# EasyEDA Pro project 51单片机.eprj

# Schematic 51单片机核心板原理图
Board Name: 51单片机核心板; Create Date: 2025-07-16; Page Name: P1; Project Name: 51单片机; Schematic Name: 51单片机核心板原理图; Update Date: 2025-07-16; Company: 嘉立创EDA; Page Size: A4; Version: V1.0
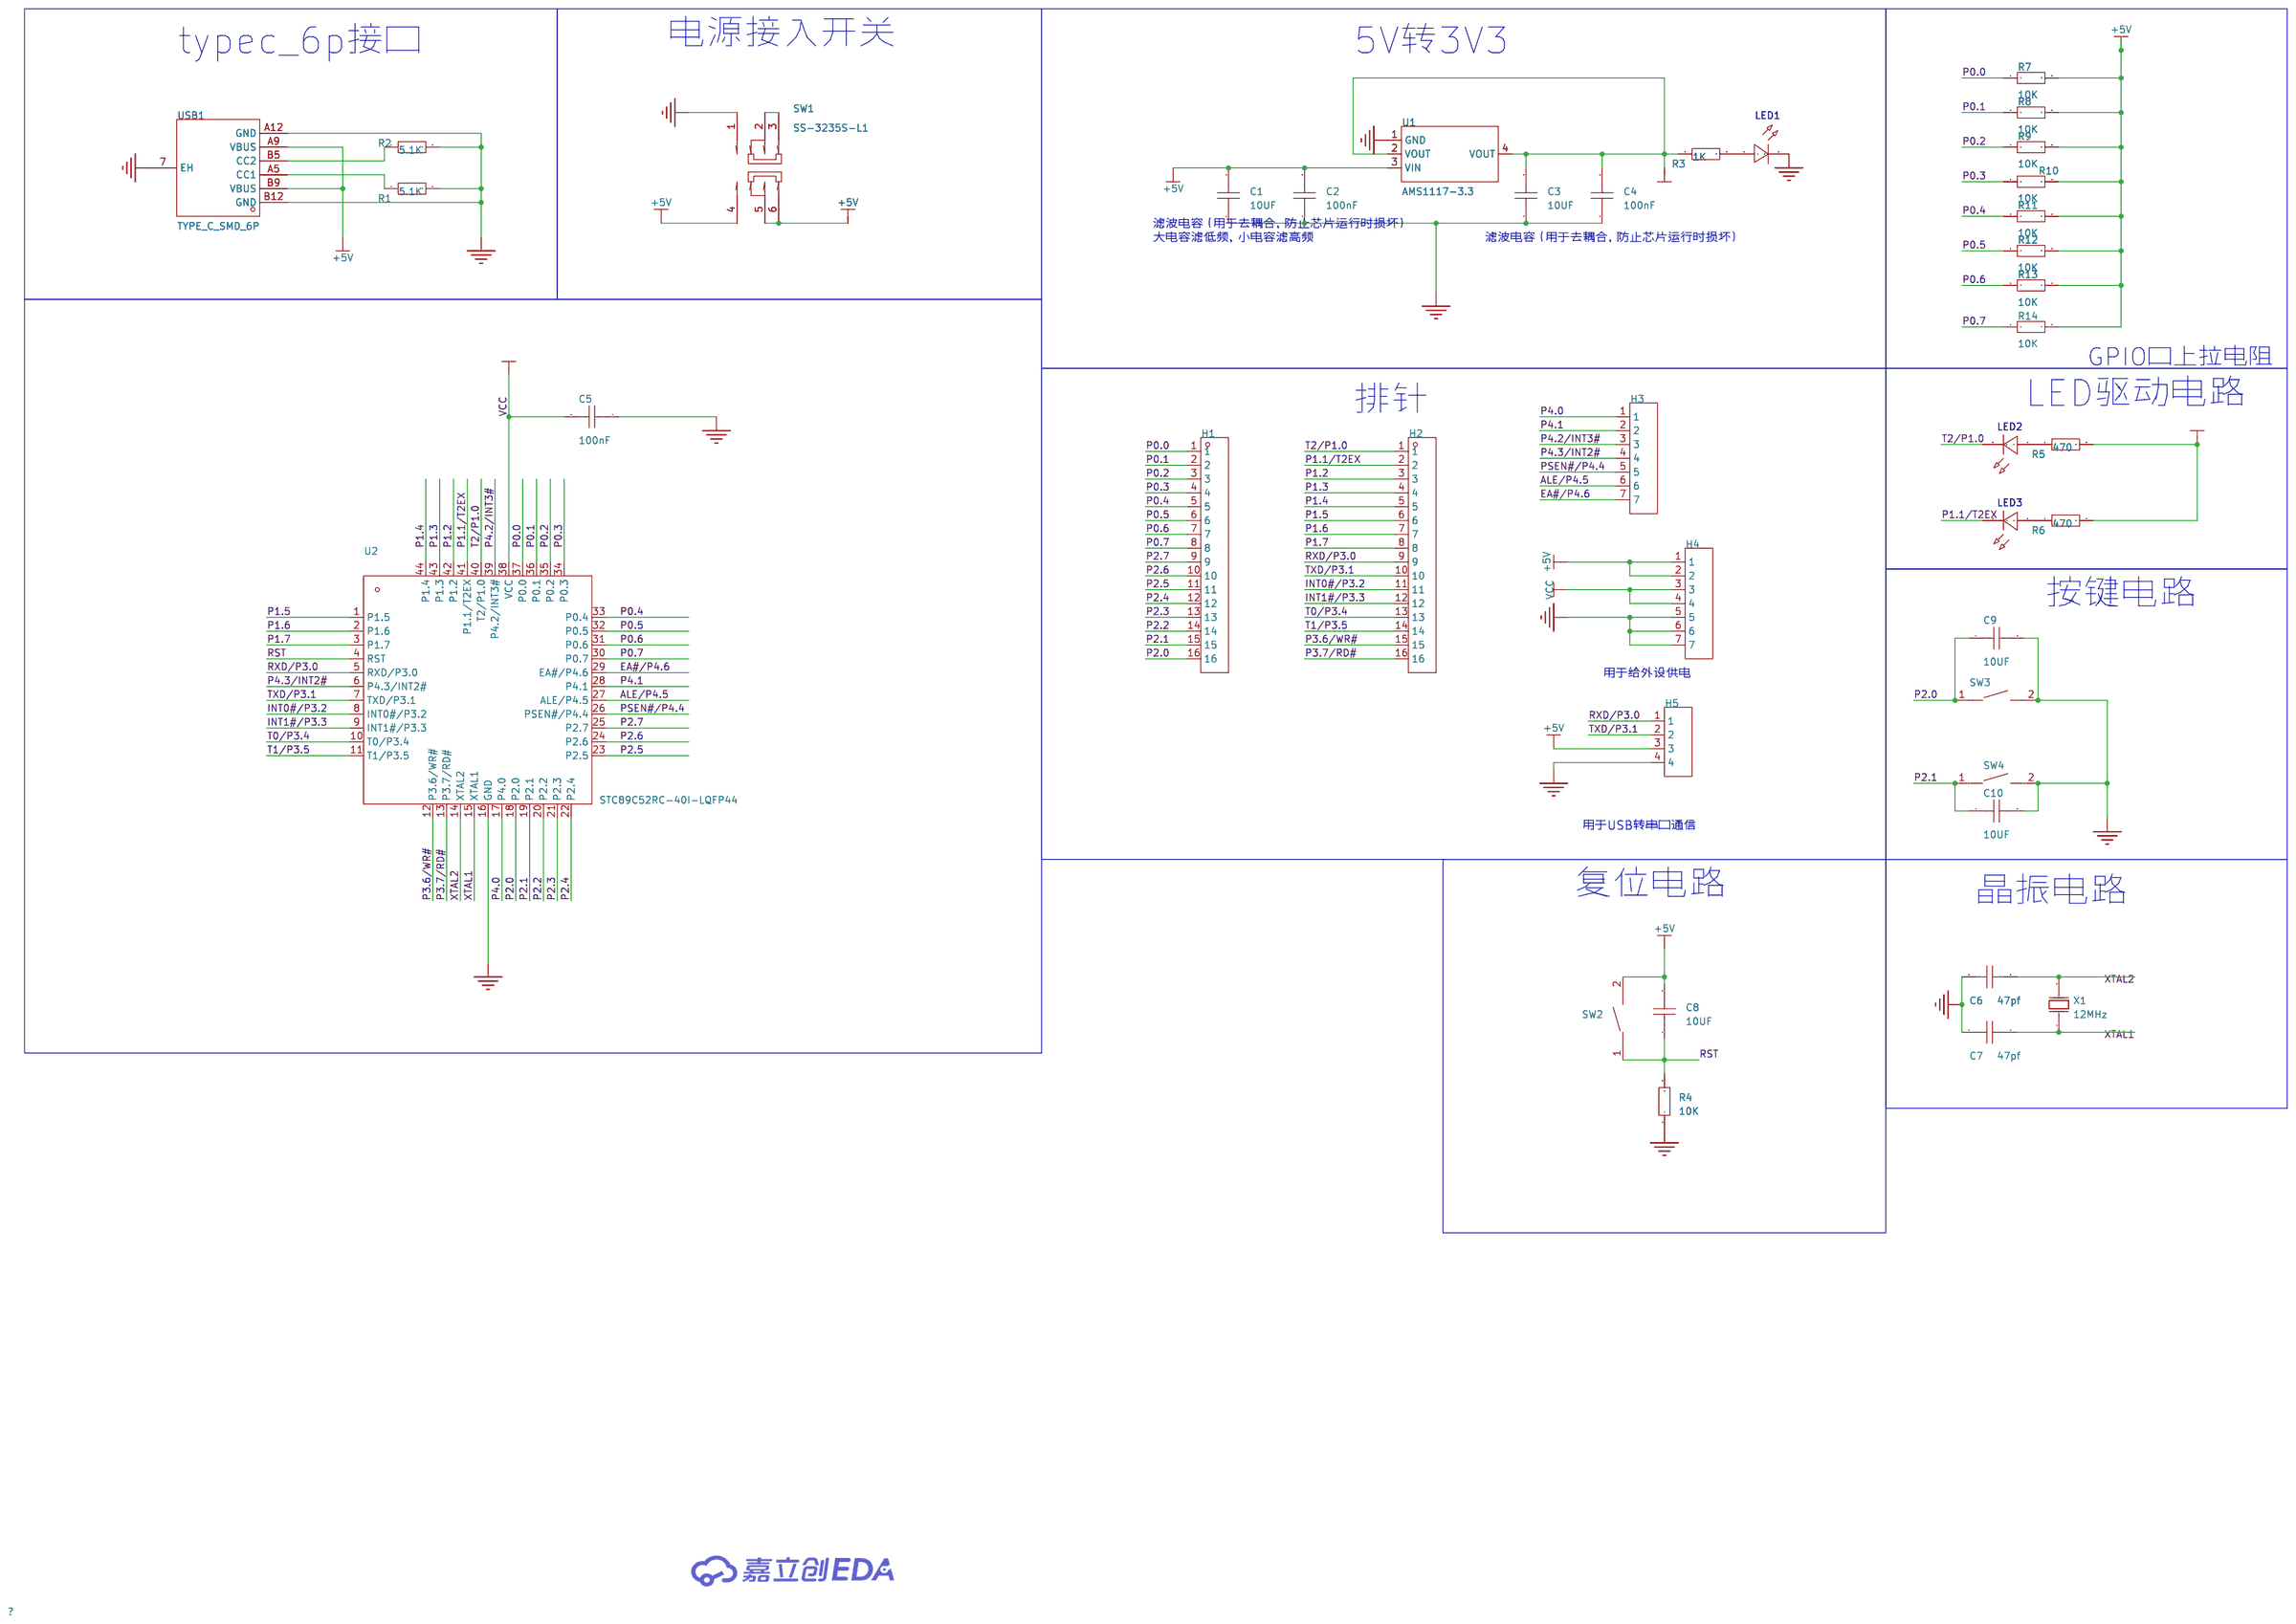
[diagram p0: schematic sheet]

## Parts
C1  10UF  [C0805]
C2  100nF  [C0805]
C3  10UF  [C0805]
C4  100nF  [C0805]
C5  100nF  [C0805]
C6  47pf  [C0805]
C7  47pf  [C0805]
C8  10UF  [C0805]
C9  10UF  [C0805]
C10  10UF  [C0805]
H1  -  [HDR-TH_16P-P2.54-V-M]
H2  -  [HDR-TH_16P-P2.54-V-M]
H3  -  [HDR-TH_7P-P2.54-V-M]
H4  -  [HDR-TH_7P-P2.54-V-M]
H5  -  [HDR-TH_4P-P2.54-V-M]
LED1  -  [LED_0805]
LED2  -  [LED_0805]
LED3  -  [LED_0805]
R1  5.1K  [R0805]
R2  5.1K  [R0805]
R3  1K  [R0805]
R4  10K  [R0805]
R5  470  [R0805]
R6  470  [R0805]
R7  10K  [R0805]
R8  10K  [R0805]
R9  10K  [R0805]
R10  10K  [R0805]
R11  10K  [R0805]
R12  10K  [R0805]
R13  10K  [R0805]
R14  10K  [R0805]
SW1  SS-3235S-L1  [SW-SMD_SS-3235S-LX]
SW2  轻触按键3*4*H  [SW-SMD_L4.0-W2.9-LS5.0]
SW3  轻触按键3*4*H  [SW-SMD_L4.0-W2.9-LS5.0]
SW4  轻触按键3*4*H  [SW-SMD_L4.0-W2.9-LS5.0]
U1  AMS1117-3.3  [SOT-223-3_L6.5-W3.4-P2.30-LS7.0-BR]
U2  STC89C52RC-40I-LQFP44  [LQFP-44_L10.0-W10.0-P0.80-LS12.0-BL]
USB1  TYPE_C_SMD_6P  [TYPE-C-SMD_TYPE-C-6P]
X1  12MHz  [CRYSTAL-SMD_L7.0-W4.0-LS7.8]

## Library data of the parts
C1-C10 = CAP_0805: Supplier Footprint: 0805
H1 H2 = HDR-M_2.54_1x16P: Supplier Part: C2894939; Supplier Footprint: 插件
H3 H4 = HDR-M_2.54_1x7P: Supplier Part: C492406; Supplier Footprint: 插件
H5 = HDR-M_2.54_1x4P: Supplier Part: C492403; Supplier Footprint: 插件
LED1-LED3 = LED_0805-G: Supplier Footprint: 0805
R1-R14 = Res_0805: Supplier Footprint: 0805
SW1 = SS-3235S-L1: LCSC Part Name: 柄长2mm 卧贴双档 滑动开关; Supplier Part: C500055; Manufacturer: XKB Connectivity(中国星坤); Supplier Footprint: SMD; JLCPCB Part Class: 扩展库; Datasheet: https://atta.szlcsc.com/upload/public/pdf/source/20211011/39D516E750C13BE9339464E723D9F132.pdf; Supplier: LCSC; Circuit: 双刀双掷; Actuator Style: 矩形柱状; Pin Style: 鸥翼型; Switch Length: 9.1mm; Switch Width: 3.55mm; Switch Height: 3.2mm; Mounting Style: 卧贴; Actuator Color: 黑色; Current Rating (DC): 50mA; Voltage Rating (DC): 12V; Current Rating (AC): 50mA; Voltage Rating (AC): 12V; Mechanical Life: 1万次; Operating Temperature: -40℃~+85℃
SW2-SW4 = 轻触按键3*4*H: Supplier Part: C9900017573; Supplier Footprint: 轻触按键3*4*2.5; JLCPCB Part Class: 扩展库; Supplier: LCSC
U1 = AMS1117-3.3_C6186: LCSC Part Name: 输出3.3V 1A; Supplier Part: C6186; Manufacturer: AMS; Supplier Footprint: SOT-223; JLCPCB Part Class: 基础库; Datasheet: https://atta.szlcsc.com/upload/public/pdf/source/20180727/C6186_7A095716F0823C02F1997A905E26C086.pdf; Supplier: LCSC; Output Type: 固定; Voltage - Supply: 16V; Output Voltage: 3.3V; Output Current: 1A; Power Supply Rejection Ratio (PSRR): 72dB@(120Hz); Voltage Dropout: 1.1V@(800mA); standby current: 5mA; Features: 过流保护；过热保护; Operating Temperature: -40℃~+125℃; Output Configuration: 正极; Number of Outputs: 1
U2 = STC89C52RC-40I-LQFP44: Supplier Part: C8707; Manufacturer: STC; Supplier Footprint: LQFP-44(10x10); JLCPCB Part Class: 扩展库; Datasheet: https://atta.szlcsc.com/upload/public/pdf/source/20241226/242305099CBBF4767F79975207B2F263.pdf; Supplier: LCSC; CPU Core: 51系列; Program Storage Size: 8KB; Program Memory Type: FLASH; Number of I/O: 39; Low Voltage Detection Threshold: 3.3V~5.5V
USB1 = TYPE_C_SMD_6P: Supplier Part: C9900003080; Supplier Footprint: TYPE_C_USB_6P; JLCPCB Part Class: 扩展库; Supplier: LCSC
X1 = 12M 20PF 15PPM: LCSC Part Name: 12MHz ±15ppm 20pF; Supplier Part: C2983432; Manufacturer: SST(索斯特); Supplier Footprint: HC-49S-SMD-2P-Mini; JLCPCB Part Class: 扩展库; Datasheet: https://atta.szlcsc.com/upload/public/pdf/source/20230331/E499E3A6C35BF666DCAD57CB31E37A5D.pdf; Supplier: LCSC; Normal temperature Frequency Tolerance: ±15ppm; Load Capacitance: 20pF; Frequency Stability: ±30ppm; Operating Temperature: -20℃~+70℃

## Nets
3V3: C3.2 C4.2 R3.1 R5.2 R6.2 U1.2(VOUT) U1.4(VOUT)
+5V: C1.2 C2.2 C8.2 H4.1 H4.2 H5.3 R7.2 R8.2 R9.2 R10.2 R11.2 R12.2 R13.2 R14.2 SW1.4 SW1.5 SW1.6 SW2.2 U1.3(VIN) USB1.A9(VBUS) USB1.B9(VBUS)
GND: C1.1 C2.1 C3.1 C4.1 C5.1 C6.1 C7.1 C9.2 C10.2 H4.5 H4.6 H4.7 H5.4 LED1.1(C) R1.2 R2.2 R4.1 SW1.1 SW3.2 SW4.2 U1.1(GND) U2.16(GND) USB1.7(EH) USB1.A12(GND) USB1.B12(GND)
VCC: C5.2 H4.3 H4.4 U2.38(VCC)
ALE/P4.5: H3.6 U2.27(ALE/P4.5)
EA#/P4.6: H3.7 U2.29(EA#/P4.6)
INT0#/P3.2: H2.11 U2.8(INT0#/P3.2)
INT1#/P3.3: H2.12 U2.9(INT1#/P3.3)
P0.0: H1.1 R7.1 U2.37(P0.0)
P0.1: H1.2 R8.1 U2.36(P0.1)
P0.2: H1.3 R9.1 U2.35(P0.2)
P0.3: H1.4 R10.1 U2.34(P0.3)
P0.4: H1.5 R11.1 U2.33(P0.4)
P0.5: H1.6 R12.1 U2.32(P0.5)
P0.6: H1.7 R13.1 U2.31(P0.6)
P0.7: H1.8 R14.1 U2.30(P0.7)
P1.1/T2EX: H2.2 LED3.1(C) U2.41(P1.1/T2EX)
P1.2: H2.3 U2.42(P1.2)
P1.3: H2.4 U2.43(P1.3)
P1.4: H2.5 U2.44(P1.4)
P1.5: H2.6 U2.1(P1.5)
P1.6: H2.7 U2.2(P1.6)
P1.7: H2.8 U2.3(P1.7)
P2.0: C9.1 H1.16 SW3.1 U2.18(P2.0)
P2.1: C10.1 H1.15 SW4.1 U2.19(P2.1)
P2.2: H1.14 U2.20(P2.2)
P2.3: H1.13 U2.21(P2.3)
P2.4: H1.12 U2.22(P2.4)
P2.5: H1.11 U2.23(P2.5)
P2.6: H1.10 U2.24(P2.6)
P2.7: H1.9 U2.25(P2.7)
P3.6/WR#: H2.15 U2.12(P3.6/WR#)
P3.7/RD#: H2.16 U2.13(P3.7/RD#)
P4.0: H3.1 U2.17(P4.0)
P4.1: H3.2 U2.28(P4.1)
P4.2/INT3#: H3.3 U2.39(P4.2/INT3#)
P4.3/INT2#: H3.4 U2.6(P4.3/INT2#)
PSEN#/P4.4: H3.5 U2.26(PSEN#/P4.4)
RST: C8.1 R4.2 SW2.1 U2.4(RST)
RXD/P3.0: H2.9 H5.1 U2.5(RXD/P3.0)
T0/P3.4: H2.13 U2.10(T0/P3.4)
T1/P3.5: H2.14 U2.11(T1/P3.5)
T2/P1.0: H2.1 LED2.1(C) U2.40(T2/P1.0)
TXD/P3.1: H2.10 H5.2 U2.7(TXD/P3.1)
XTAL1: C7.2 U2.15(XTAL1) X1.1(OSC1)
XTAL2: C6.2 U2.14(XTAL2) X1.2(OSC2)
$1N263: R1.1 USB1.A5(CC1)
$1N267: R2.1 USB1.B5(CC2)
$1N532: SW1.2 SW1.3
$1N934: LED1.2(A) R3.2
$1N3338: LED2.2(A) R5.1
$1N3364: LED3.2(A) R6.1

## Notes on the sheet
- typec_6p接口
- 电源接入开关
- 5V转3V3
- 滤波电容（用于去耦合，防止芯片运行时损坏）
  大电容滤低频，小电容滤高频
- 滤波电容（用于去耦合，防止芯片运行时损坏）
- GPIO口上拉电阻
- 排针
- LED驱动电路
- 按键电路
- 用于给外设供电
- 用于USB转串口通信
- 复位电路
- 晶振电路

# Board 51单片机核心板PCB
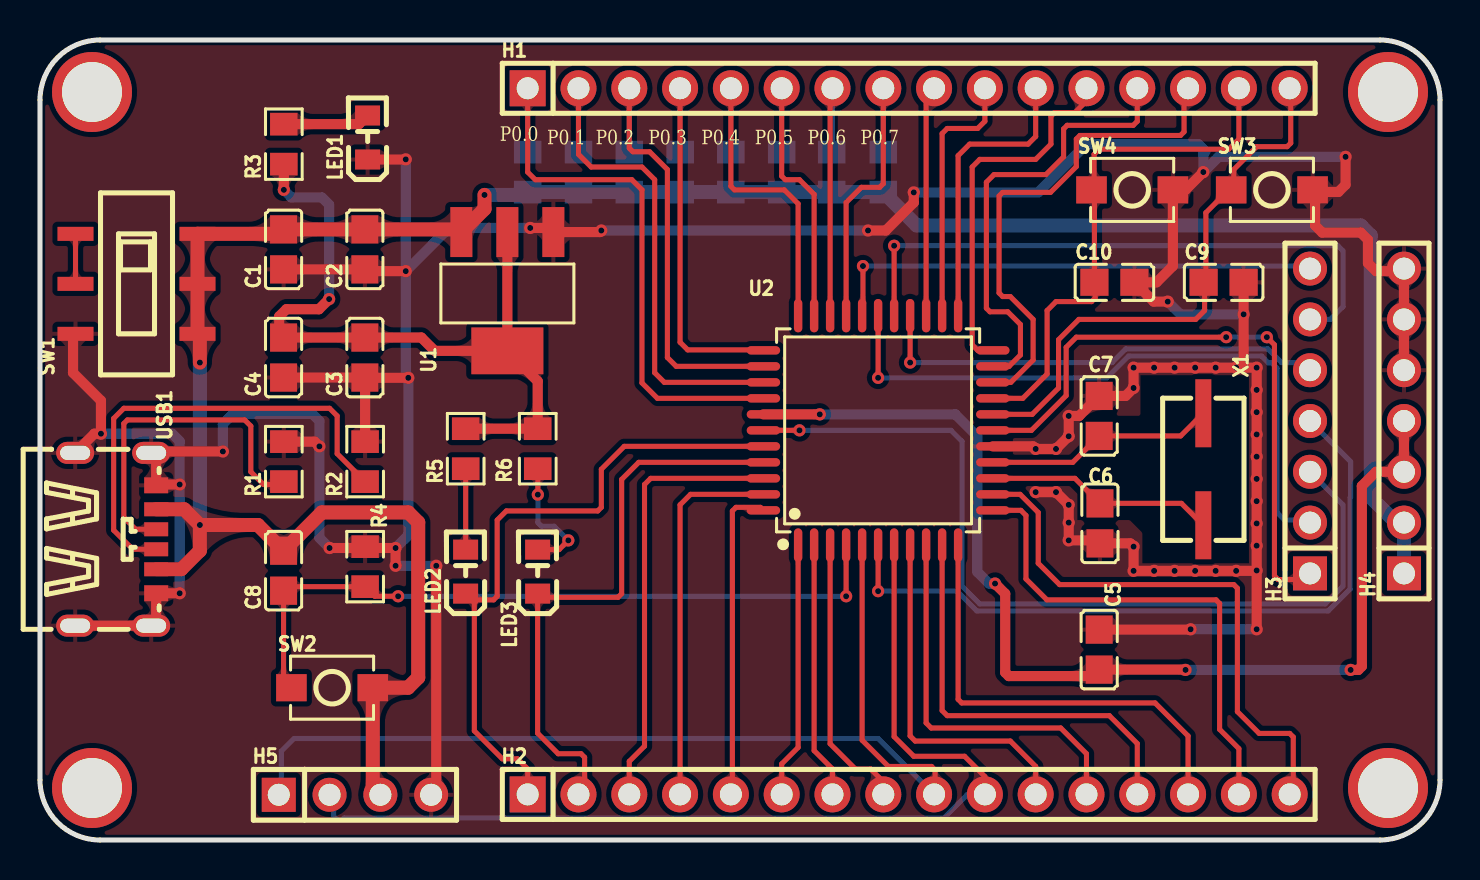
[diagram p1: board, top side]
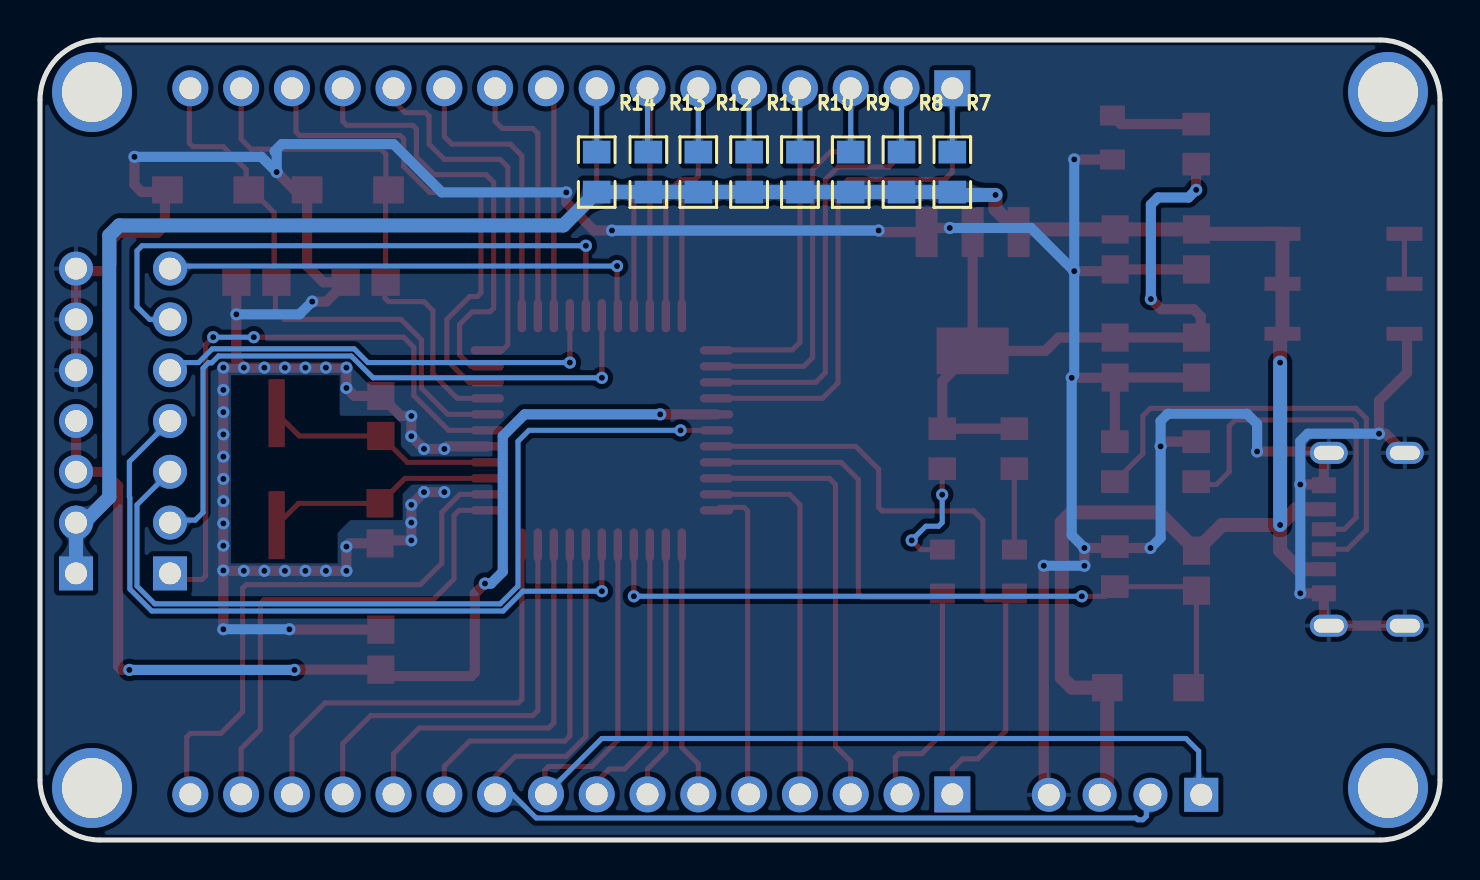
[diagram p2: board, bottom side, seen from below]

Outline 70 x 40 mm; copper layers: Top Layer, Bottom Layer. Coordinates in mm from the lower left corner of the outline.
Outline path: 0,37 0,3 arc(0.88,0.88) 3,0 67,0 arc(69.12,0.88) 70,3 70,37 arc(69.12,39.12) 67,40 3,40 arc(0.88,39.12) 0,37
Stack: Top Layer 0.035mm / Dielectric1 1.51mm FR4 er 4.5 / Bottom Layer 0.035mm

## Design rules (mm)
net XTAL2: DP1
net XTAL1: DP1
template: JLCPCB Capability(Two Layers Board)
spacing copperThickness1oz (default): track to track 0.102, other pairs 0.152 to 0.3
spacing copperThickness2oz: track to track 0.203, other pairs 0.152 to 0.3
track width copperThickness1oz (default): min 0.127, default 0.254, max 2.54
track width copperThickness2oz: min 0.203, default 0.254, max 2.54
differential pair differentialPair (default): width min 0.127, default 0.254, max 2.54; gap min 0.152, default 0.152
via viaSize (default): diameter min 0.5, default 0.61, max 10; hole min 0.3, default 0.305, max 6.3

## Placement (name value [footprint] x y rotation side)
C1  10UF  [C0805]  12.18 29.53 90 top
C2  100nF  [C0805]  16.24 29.53 90 top
C3  10UF  [C0805]  16.24 24.12 90 top
C4  100nF  [C0805]  12.18 24.12 90 top
C5  100nF  [C0805]  52.96 9.52 270 top
C6  47pf  [C0805]  53 15.83 90 top
C7  47pf  [C0805]  52.96 21.2 270 top
C8  10UF  [C0805]  12.18 13.47 90 top
C9  10UF  [C0805]  59.18 27.88 0 top
C10  10UF  [C0805]  53.72 27.88 0 top
H1  -  [HDR-TH_16P-P2.54-V-M]  43.43 37.59 0 top
H2  -  [HDR-TH_16P-P2.54-V-M]  43.43 2.28 0 top
H3  -  [HDR-TH_7P-P2.54-V-M]  63.5 20.95 90 top
H4  -  [HDR-TH_7P-P2.54-V-M]  68.2 20.95 90 top
H5  -  [HDR-TH_4P-P2.54-V-M]  15.75 2.26 0 top
LED1  -  [LED_0805]  16.38 35.17 90 top
LED2  -  [LED_0805]  21.28 13.47 90 top
LED3  -  [LED_0805]  24.89 13.47 90 top
NOREF  -  [Pad_e41]  2.6 37.4 0 top
NOREF#2  -  [Pad_e46]  67.4 2.6 0 top
NOREF#3  -  [Pad_e45]  2.6 2.6 0 top
NOREF#4  -  [Pad_e47]  67.4 37.4 0 top
R1  5.1K  [R0805]  12.19 18.92 90 top
R2  5.1K  [R0805]  16.26 18.92 90 top
R3  1K  [R0805]  12.19 34.79 90 top
R4  10K  [R0805]  16.26 13.67 270 top
R5  470  [R0805]  21.28 19.57 90 top
R6  470  [R0805]  24.89 19.57 90 top
R7  10K  [R0805]  24.38 33.4 270 bottom
R8  10K  [R0805]  26.92 33.4 270 bottom
R9  10K  [R0805]  29.46 33.4 270 bottom
R10  10K  [R0805]  32 33.4 270 bottom
R11  10K  [R0805]  34.54 33.4 270 bottom
R12  10K  [R0805]  37.08 33.4 270 bottom
R13  10K  [R0805]  39.58 33.4 270 bottom
R14  10K  [R0805]  42.16 33.4 270 bottom
SW1  SS-3235S-L1  [SW-SMD_SS-3235S-LX]  4.83 27.81 90 top
SW2  轻触按键3*4*H  [SW-SMD_L4.0-W2.9-LS5.0]  14.61 7.61 0 top
SW3  轻触按键3*4*H  [SW-SMD_L4.0-W2.9-LS5.0]  61.59 32.51 0 top
SW4  轻触按键3*4*H  [SW-SMD_L4.0-W2.9-LS5.0]  54.61 32.51 0 top
U1  AMS1117-3.3  [SOT-223-3_L6.5-W3.4-P2.30-LS7.0-BR]  23.37 27.43 90 top
U2  STC89C52RC-40I-LQFP44  [LQFP-44_L10.0-W10.0-P0.80-LS12.0-BL]  41.91 20.48 0 top
USB1  TYPE_C_SMD_6P  [TYPE-C-SMD_TYPE-C-6P]  3.78 15.04 270 top
X1  12MHz  [CRYSTAL-SMD_L7.0-W4.0-LS7.8]  58.17 18.54 270 top

## Footprints (pads in the part's own frame, mm; a bottom-side part is the same pattern mirrored in y, then rotated)
C0805
  rect 1.41x1.35 smd: 1(-1,0) 2(1,0)
CRYSTAL-SMD_L7.0-W4.0-LS7.8
  rect 3.4x0.8 smd: 1(-2.8,0) 2(2.8,0)
HDR-TH_4P-P2.54-V-M
  rect 1.7x1.7 hole 1.1: 1(-3.81,0)
  round 1.7 hole 1.1: 2(-1.27,0) 3(1.27,0) 4(3.81,0)
HDR-TH_7P-P2.54-V-M
  rect 1.7x1.7 hole 1.1: 1(-7.62,0)
  round 1.7 hole 1.1: 2(-5.08,0) 3(-2.54,0) 4(0,0) 5(2.54,0) 6(5.08,0) 7(7.62,0)
HDR-TH_16P-P2.54-V-M
  rect 1.8x1.8 hole 1.1: 1(-19.05,0)
  round 1.8 hole 1.1: 2(-16.51,0) 3(-13.97,0) 4(-11.43,0) 5(-8.89,0) 6(-6.35,0) 7(-3.81,0) 8(-1.27,0) 9(1.27,0) 10(3.81,0) 11(6.35,0) 12(8.89,0) 13(11.43,0) 14(13.97,0) 15(16.51,0) 16(19.05,0)
LED_0805
  rect 1x1.25 smd: 1(-1.15,0.005) 2(1.05,0.005)
LQFP-44_L10.0-W10.0-P0.80-LS12.0-BL
  oval 0.42x1.67 smd: 1(-4,-5.735) 2(-3.2,-5.735) 3(-2.4,-5.735) 4(-1.6,-5.735) 5(-0.8,-5.735) 6(0,-5.735) 7(0.8,-5.735) 8(1.6,-5.735) 9(2.4,-5.735) 10(3.2,-5.735) 11(4,-5.735) 23(4,5.735) 24(3.2,5.735) 25(2.4,5.735) 26(1.6,5.735) 27(0.8,5.735) 28(0,5.735) 29(-0.8,5.735) 30(-1.6,5.735) 31(-2.4,5.735) 32(-3.2,5.735) 33(-4,5.735)
  oval 1.67x0.42 smd: 12(5.735,-4) 13(5.735,-3.2) 14(5.735,-2.4) 15(5.735,-1.6) 16(5.735,-0.8) 17(5.735,0) 18(5.735,0.8) 19(5.735,1.6) 20(5.735,2.4) 21(5.735,3.2) 22(5.735,4) 34(-5.735,4) 35(-5.735,3.2) 36(-5.735,2.4) 37(-5.735,1.6) 38(-5.735,0.8) 39(-5.735,0) 40(-5.735,-0.8) 41(-5.735,-1.6) 42(-5.735,-2.4) 43(-5.735,-3.2) 44(-5.735,-4)
Pad_e41
  round 4 hole 3: 1(0,0)
Pad_e45
  round 4 hole 3: 1(0,0)
Pad_e46
  round 4 hole 3: 1(0,0)
Pad_e47
  round 4 hole 3: 1(0,0)
R0805
  rect 1.133x1.377 smd: 1(-1,0) 2(1,0)
SOT-223-3_L6.5-W3.4-P2.30-LS7.0-BR
  rect 2.5x1.1 smd: 1(2.97,-2.3) 2(2.97,0) 3(2.97,2.3)
  rect 2.34x3.6 smd: 4(-2.97,0)
SW-SMD_L4.0-W2.9-LS5.0
  rect 1.53x1.36 smd: 1(-2.035,0) 2(2.035,0)
SW-SMD_SS-3235S-LX
  rect 0.7x1.8 smd: 1(-2.5,3.05) 2(0,3.05) 3(2.5,3.05) 4(-2.5,-3.05) 5(0,-3.05) 6(2.5,-3.05)
TYPE-C-SMD_TYPE-C-6P
  oval 1.1x1.9 hole 0.7x1.5: 7(-4.32,1.775) 7(-4.32,-2.025) 7(4.32,1.775) 7(4.32,-2.025)
  rect 0.7x1.2 smd: A5(-0.5,2.025) A9(1.5,2.025) B5(0.5,2.025) B9(-1.5,2.025)
  rect 0.8x1.2 smd: A12(2.7,2.025) B12(-2.7,2.025)

## Nets
As in the schematic.

Pads without a net: NOREF 1; NOREF#2 1; NOREF#3 1; NOREF#4 1

## Via types
v1: diameter 0.61, hole 0.305, Top Layer to Bottom Layer, 76 vias

## Routing (per net, layer and track width the routed paths; a pad name or vN(x,y) marks a point on that pad's centre or on a via; arc(x,y) is an arc through that point)
3V3: length 38.1
  Top Layer w0.508: 23.37,24.46 19.73,24.46 19.07,25.12 C3.2 C4.2 11.96,25.34 11.96,26.18 12.32,26.54 13.95,26.54 v1(14.46,27.05) ; 23.37,24.46 24.89,22.94 R6.2 R5.2 ; 23.37,24.46 U1.2 ; R3.1 v1(12.19,32.51)
  Bottom Layer w0.508: v1(14.46,27.05) 14.46,31.77 14.1,32.13 12.57,32.13 v1(12.19,32.51)
+5V: length 127.9
  Top Layer w0.686: 7.99,14.47 7.06,13.54 USB1.A9
  Top Layer w0.701: v1(7.99,15.75) 7.99,14.47 ; v1(7.99,15.75) 10.89,15.75 C8.2 14.09,16.38 18.41,16.38 18.91,15.88 18.91,8.12 18.4,7.61 SW2.2 16.64,2.64 H5.3 ; v1(7.99,15.75) 7.21,16.54 USB1.B9 ; v1(7.99,23.87) 7.99,25.19 SW1.4 SW1.5 SW1.6 11.96,30.31 C1.2 C2.2 20.94,30.53 U1.3 22.22,31.55 v1(22.22,32.25)
  Bottom Layer w0.701: H4.1 H4.2 67.81,15.87 66.54,17.14 66.54,30.23 66.04,30.73 43.83,30.73 R14.2 R13.2 R12.2 R11.2 R10.2 R9.2 R8.2 R7.2 24.24,32.25 v1(22.22,32.25) ; v1(7.99,15.75) v1(7.99,23.87)
GND: length 240.2
  Top Layer w0.508: USB1.7 2.72,20.31 v1(3.05,20.31) 3.05,21.97 1.65,23.36 1.65,25.18 SW1.1 ; v1(41.4,30.47) 42.29,30.47 43.69,31.87 v1(43.69,32.38) ; v1(24.51,30.6) 25.46,30.6 U1.1 27.99,30.4 v1(28.07,30.47) ; v1(18.29,28.44) 16.33,28.44 C2.1 C1.1 ; USB1.7 5.56,10.72 5.81,10.97 USB1.A12 v1(6.98,12.34) ; v1(58.17,33.4) 57.28,32.51 SW4.2 56.65,28.7 55.83,27.88 C10.2 55.69,26.92 v1(56.39,26.92) ; C4.1 C3.1 16.26,23.11 ; v1(60.83,13.48) v1(60.83,14.72) v1(60.83,15.83) v1(60.83,16.94) v1(60.83,18.05) v1(60.83,19.17) v1(60.83,20.28) v1(60.83,21.39) v1(60.83,22.5) v1(60.83,23.62) v1(59.81,23.62) ; v1(60.83,13.48) 60.81,13.46 v1(59.81,13.46) v1(58.78,13.46) v1(57.76,13.46) v1(56.73,13.46) v1(55.71,13.46) v1(54.68,13.46) v1(54.68,14.67) 54.52,14.83 C6.1 52.85,14.98 v1(51.44,14.98) v1(51.44,15.87) v1(51.44,16.76) v1(50.8,17.39) v1(49.78,17.39) ; v1(60.83,13.48) v1(60.83,10.54) ; H5.4 19.81,2.52 v1(19.81,13.71) ; v1(6.98,17.78) 5.85,17.78 USB1.B12 5.81,19.11 5.56,19.36 5.63,19.43 v1(9.14,19.43) ; 63.74,32.4 SW3.2 ; 63.74,32.4 63.75,32.38 63.75,30.73 64.11,30.37 66.04,30.37 66.4,30.01 66.4,28.85 66.8,28.44 68.07,28.44 H4.7 H4.6 H4.5 ; 63.74,32.4 64.92,32.4 65.28,32.76 v1(65.28,34.16) ; v1(57.53,10.54) 57.51,10.52 C5.1 ; C9.2 v1(60.18,26.28) 60.18,23.99 v1(59.81,23.62) ; v1(13.97,19.68) 13.73,19.92 R1.2 ; LED1.1 18.28,34.02 v1(18.29,34.03) ; v1(18.41,23.11) 16.26,23.11 ; 16.26,23.11 R2.2 ; v1(59.81,23.62) v1(58.78,23.62) v1(57.76,23.62) v1(56.73,23.62) v1(55.71,23.62) v1(54.68,23.62) v1(54.68,22.6) 54.28,22.2 C7.1 51.96,21.2 v1(51.44,21.2) v1(51.44,20.19) v1(50.8,19.55) v1(49.78,19.55) 49.66,19.68 U2.16 ; v1(17.78,13.71) v1(17.78,14.6) 16.32,14.6 R4.1 16.19,14.6 v1(14.48,14.6)
  Bottom Layer w0.508: v1(18.29,28.44) 18.29,23.24 v1(18.41,23.11) 18.41,15.23 v1(17.78,14.6) ; v1(18.29,28.44) 20.45,30.6 v1(24.51,30.6) ; v1(18.29,28.44) v1(18.29,34.03) ; v1(56.39,26.92) 57.02,26.28 v1(60.18,26.28) ; v1(6.98,12.34) v1(6.98,17.78) 6.98,19.93 6.6,20.31 v1(3.05,20.31) ; v1(17.78,13.71) v1(19.81,13.71) ; v1(65.28,34.16) 58.93,34.16 v1(58.17,33.4) 58.17,34.33 58.27,34.43 57.91,34.79 52.32,34.79 49.91,32.38 v1(43.69,32.38) ; v1(57.53,10.54) v1(60.83,10.54) ; v1(9.14,19.43) 9.14,20.8 9.65,21.31 13.61,21.31 13.97,20.95 v1(13.97,19.68) 13.97,15.11 v1(14.48,14.6) ; v1(28.07,30.47) v1(41.4,30.47)
VCC: length 55.8
  Top Layer w0.508: H4.4 H4.3 66.8,18.41 66.09,17.7 66.09,8.68 65.91,8.5 v1(65.53,8.5) ; U2.38 v1(38.99,21.28) ; v1(57.28,8.5) 57.26,8.52 C5.2 52.64,8.2 48.44,8.2 48.26,8.38 48.26,12.31 v1(47.75,12.82)
  Bottom Layer w0.508: v1(47.75,12.82) 47.45,12.82 46.86,13.41 46.86,20.19 45.77,21.28 v1(38.99,21.28) ; v1(57.28,8.5) v1(65.53,8.5)
ALE/P4.5: length 30.8
  Top Layer w0.254: 42.71,26.22 v1(42.71,29.71)
  Bottom Layer w0.254: H3.6 64.52,26.03 65.15,26.67 65.15,29.46 64.9,29.71 v1(42.71,29.71)
EA#/P4.6: length 24.9
  Top Layer w0.254: 41.11,26.22 41.15,26.26 v1(41.15,28.7)
  Bottom Layer w0.254: H3.7 63.37,28.7 v1(41.15,28.7)
INT0#/P3.2: length 17.9
  Top Layer w0.254: H2.11 49.78,3.68 48.51,4.95 43.76,4.95 43.51,5.2 U2.8
INT1#/P3.3: length 19.6
  Top Layer w0.254: U2.9 44.31,5.85 44.56,5.6 51.04,5.6 52.32,4.31 H2.12
P0.0: length 29.5
  Top Layer w0.254: H1.1 24.38,33.4 24.76,33.02 29.59,33.02 30.1,32.51 30.1,22.86 30.87,22.08 U2.37
  Bottom Layer w0.254: H1.1 R7.1
P0.1: length 26.1
  Top Layer w0.254: U2.36 31.22,22.88 30.73,23.36 30.73,33.02 30.1,33.65 27.56,33.65 26.92,34.28 H1.2
  Bottom Layer w0.254: H1.2 R8.1
P0.2: length 22.9
  Top Layer w0.254: H1.3 29.46,34.59 29.64,34.41 30.48,34.41 31.37,33.52 31.37,24.12 31.81,23.68 U2.35
  Bottom Layer w0.254: H1.3 R9.1
P0.3: length 20.2
  Top Layer w0.254: U2.34 36.15,24.51 32.38,24.51 32,24.89 H1.4
  Bottom Layer w0.254: H1.4 R10.1
P0.4: length 17.4
  Top Layer w0.254: H1.5 34.54,32.69 34.72,32.51 37.21,32.51 37.91,31.81 37.91,26.22
  Bottom Layer w0.254: H1.5 R11.1
P0.5: length 15.6
  Top Layer w0.254: H1.6 37.08,33.19 37.26,33.02 37.97,33.02 38.71,32.28 38.71,26.22
  Bottom Layer w0.254: H1.6 R12.1
P0.6: length 14.6
  Top Layer w0.254: 39.51,26.22 39.51,37.47 H1.7
  Bottom Layer w0.254: R13.1 39.62,34.44 H1.7
P0.7: length 15.9
  Top Layer w0.254: H1.8 42.16,32.81 41.98,32.63 41.07,32.63 40.31,31.87 40.31,26.22
  Bottom Layer w0.254: H1.8 R14.1
P1.1/T2EX: length 29.3
  Top Layer w0.254: H2.2 27.23,2.59 27.23,4.13 27.05,4.31 25.91,4.31 24.88,5.34 LED3.1 25.07,12.13 28.9,12.13 29.08,12.31 29.08,18.03 29.94,18.88 U2.41
P1.2: length 21.9
  Top Layer w0.254: U2.42 30.53,18.08 30.23,17.78 30.23,4.69 29.46,3.93 H2.3
P1.3: length 18.9
  Top Layer w0.254: U2.43 32.53,17.28 32,16.76 H2.4
P1.4: length 15.9
  Top Layer w0.254: H2.5 34.62,2.36 34.62,16.45 34.8,16.63 36.02,16.63 U2.44
P1.5: length 12.8
  Top Layer w0.254: H2.6 37.08,3.81 37.91,4.63 U2.1
P1.6: length 12.8
  Top Layer w0.254: U2.2 38.71,4.47 39.62,3.55 H2.7
P1.7: length 14
  Top Layer w0.254: U2.3 39.51,4.81 40.77,3.55 41.53,3.55 42.16,2.92 H2.8
P2.0: length 28.1
  Top Layer w0.254: H1.16 62.54,37.53 62.54,34.85 62.36,34.67 60.83,34.67 59.69,33.52 59.69,32.64 SW3.1 59.44,32.51 58.29,31.36 58.29,28 C9.1 58.23,27.84 58.23,26.47 57.78,26.03 51.94,26.03 50.93,25.01 50.93,22.6 49.61,21.28 U2.18
P2.1: length 26.5
  Top Layer w0.254: U2.19 49.14,22.08 50.36,23.3 50.36,26.47 50.8,26.92 52.58,26.92 52.76,27.1 52.76,27.85 C10.1 52.72,32.36 SW4.1 52.71,32.64 52.71,34.28 52.96,34.54 59.44,34.54 59.94,35.05 H1.15
P2.2: length 25.3
  Top Layer w0.254: H1.14 57.2,37.39 57.2,35.41 57.02,35.23 52,35.23 51.82,35.05 51.82,33.67 50.52,32.38 48.13,32.38 47.95,32.2 47.95,27.35 48.13,27.17 48.51,27.17 49.66,26.03 49.66,24 48.54,22.88 U2.20
P2.3: length 22.8
  Top Layer w0.254: U2.21 48.45,23.68 49.02,24.25 49.02,25.78 48.39,26.41 47.5,26.41 47.32,26.59 47.32,32.89 47.7,33.27 50.29,33.27 51.18,34.16 51.18,35.56 51.36,35.73 54.66,35.73 54.86,35.94 H1.13
P2.4: length 18.6
  Top Layer w0.254: H1.12 52.32,37.46 52.38,37.41 52.38,37 51.74,36.37 50.73,36.37 50.55,36.19 50.55,34.79 49.78,34.03 46.99,34.03 46.61,33.65 46.61,24.76 46.89,24.48 U2.22
P2.5: length 14.7
  Top Layer w0.254: H1.11 49.78,35.17 49.4,34.79 46.48,34.79 45.91,34.22 U2.23
P2.6: length 13.1
  Top Layer w0.254: H1.10 47.24,35.94 46.88,35.58 45.36,35.58 45.11,35.32 45.11,26.22
P2.7: length 11.5
  Top Layer w0.254: U2.25 44.31,37.06 44.7,37.46 H1.9
P3.6/WR#: length 25.1
  Top Layer w0.254: H2.15 59.94,4.57 58.98,5.53 58.98,11.83 58.8,12.01 50.34,12.01 49.3,13.05 49.3,16.23 49.04,16.48 U2.12
P3.7/RD#: length 28.1
  Top Layer w0.254: U2.13 49.01,17.28 49.91,16.38 49.91,13.84 50.98,12.77 59.69,12.77 59.87,12.59 59.87,6.42 60.96,5.33 62.48,5.33 62.66,5.15 62.66,2.46 H2.16
P4.0: length 31.1
  Top Layer w0.254: U2.17 49.57,20.48 51.31,22.22 51.31,24.63 51.82,25.14 v1(59.31,25.14) ; v1(61.34,25.14) 61.72,24.76 61.72,13.2 61.9,13.02 63.19,13.02 H3.1
  Bottom Layer w0.254: v1(59.31,25.14) v1(61.34,25.14)
P4.1: length 32.8
  Top Layer w0.254: 41.91,26.22 v1(41.91,23.11)
  Bottom Layer w0.254: v1(41.91,23.11) 53.35,23.11 54.44,24.2 61.07,24.2 61.42,23.86 61.58,23.86 61.85,23.59 61.85,16.38 62.23,16 63.37,16 H3.2
P4.2/INT3#: length 43.6
  Top Layer w0.254: U2.39 v1(37.97,20.48)
  Bottom Layer w0.254: v1(37.97,20.48) 45.55,20.48 46.1,19.93 46.1,12.69 46.99,11.81 64.26,11.81 65.15,12.69 65.15,16.76 H3.3
P4.3/INT2#: length 36
  Top Layer w0.254: U2.6 v1(41.91,12.44)
  Bottom Layer w0.254: H3.4 65.53,18.92 65.53,17.14 65.51,17.11 65.51,12.55 64.41,11.45 46.84,11.45 45.85,12.44 v1(41.91,12.44)
PSEN#/P4.4: length 23.1
  Top Layer w0.254: 43.51,26.22 v1(43.51,23.87)
  Bottom Layer w0.254: H3.5 63.12,23.87 62.07,23.87 61.39,24.56 54.29,24.56 53.6,23.87 v1(43.51,23.87)
RST: length 36
  Top Layer w0.254: U2.4 v1(40.31,12.19) ; SW2.1 12.18,8.01 C8.1 12.38,12.67 R4.2 16.74,12.19 v1(17.91,12.19)
  Bottom Layer w0.254: v1(40.31,12.19) v1(17.91,12.19)
RXD/P3.0: length 51.6
  Top Layer w0.254: U2.5 41.11,4.99 42.42,3.68 44.58,3.68 44.76,3.5 44.76,2.33 H2.9
  Bottom Layer w0.254: H5.1 12.06,2.39 12.06,4.44 12.7,5.08 41.91,5.08 H2.9
T0/P3.4: length 21.3
  Top Layer w0.254: H2.13 54.86,4.82 53.47,6.22 45.36,6.22 45.11,6.47 U2.10
T1/P3.5: length 22.9
  Top Layer w0.254: U2.11 45.91,7.03 46.09,6.85 55.75,6.85 57.4,5.2 H2.14
T2/P1.0: length 32.9
  Top Layer w0.254: U2.40 29.21,19.68 28.07,18.54 28.07,16.63 27.89,16.45 23.32,16.45 22.86,16 22.86,12.19 22.68,12.01 21.59,12.01 ; 21.59,12.01 LED2.1 ; 21.59,12.01 21.72,11.88 21.72,5.46 23.11,4.06 23.88,4.06 24.38,3.55 H2.1
TXD/P3.1: length 50.2
  Top Layer w0.254: U2.7 42.71,5.17 43.69,4.19 46.23,4.19 47.24,3.17 H2.10
  Bottom Layer w0.254: H5.2 14.68,2.06 14.68,1.19 14.86,1.01 15.11,1.01 15.2,1.1 45.19,1.1 46.37,2.28 H2.10
XTAL1: length 11.5
  Top Layer w0.254: X1.1 57.03,20.2 C7.2 51.64,18.88 U2.15
XTAL2: length 11.5
  Top Layer w0.254: 58.17,15.74 57.07,16.83 C6.2 51.75,18.08 U2.14
$1N263: length 17.4
  Top Layer w0.254: USB1.A5 4.78,15.54 4.19,16.12 4.19,20.82 4.37,21 10.23,21 10.54,20.7 10.54,18.41 11.18,17.78 12.05,17.78 R1.1
$1N267: length 23.5
  Top Layer w0.254: USB1.B5 4.64,14.54 3.68,15.49 3.68,21.08 4.19,21.58 14.48,21.58 14.86,21.2 14.86,19.31 R2.1
$1N532: length 2.5
  Top Layer w0.254: SW1.2 SW1.3
$1N934: length 4.4
  Top Layer w0.508: R3.2 15.95,35.79 LED1.2
$1N3338: length 4
  Top Layer w0.254: LED2.2 21.28,14.52 R5.1
$1N3364: length 6.3
  Top Layer w0.254: LED3.2 25.95,14.52 v1(26.42,14.98) ; v1(24.89,17.27) 24.89,18.56 R6.1
  Bottom Layer w0.254: v1(24.89,17.27) 24.89,15.87 25.07,15.69 25.71,15.69 v1(26.42,14.98)

## Copper pours and planes (outline as drawn; the poured copper is in the pictures)
GND on Top Layer: -1.78,41.27 71.75,41.27 71.75,-1.4 -1.78,-1.4
GND on Bottom Layer: -1.78,41.52 71.37,41.52 71.37,-0.77 -1.78,-0.77

Small or netless copper shapes (teardrops, artwork), in the pictures only: 251 on Top Layer, 87 on Bottom Layer

## Text on the board
Top Silkscreen Layer: P0.1 | P0.2 | P0.3 | P0.4 | P0.5 | P0.6 | P0.7 | P0.0
